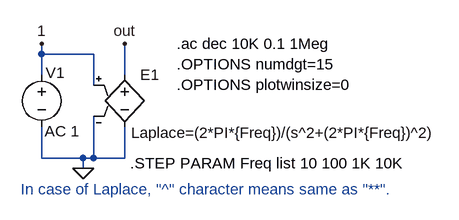
[diagram p0: schematic Fig_2-76-app_E-Laplace_Test_SIN.asc]
Fig_2-76-app_E-Laplace_Test_SIN.asc, the LTspice schematic file:
Version 4
SHEET 1 920 680
WIRE 32 112 32 96
WIRE 112 112 32 112
WIRE 32 144 32 112
WIRE 160 144 160 96
WIRE 112 160 112 112
WIRE 32 272 32 224
WIRE 96 272 32 272
WIRE 112 272 112 208
WIRE 112 272 96 272
WIRE 160 272 160 224
WIRE 160 272 112 272
WIRE 96 288 96 272
FLAG 96 288 0
FLAG 32 96 1
FLAG 160 96 out
SYMBOL e 160 128 R0
WINDOW 3 10 105 Left 2
SYMATTR Value Laplace=(2*PI*{Freq})/(s^2+(2*PI*{Freq})^2)
SYMATTR InstName E1
SYMBOL voltage 32 128 R0
WINDOW 123 5 103 Left 2
WINDOW 39 0 0 Left 2
WINDOW 0 6 13 Left 2
SYMATTR Value2 AC 1
SYMATTR InstName V1
SYMATTR Value ""
TEXT 240 96 Left 2 !.ac dec 10K 0.1 1Meg
TEXT 240 128 Left 2 !.OPTIONS numdgt=15\n.OPTIONS plotwinsize=0
TEXT 0 320 Left 2 ;In case of Laplace, "^" character means same as "**".
TEXT 168 280 Left 2 !.STEP PARAM Freq list 10 100 1K 10K

The netlist it stands for:
* Fig_2-76-app_E-Laplace_Test_SIN.asc
E1 out 0 1 0 Laplace=(2*PI*{Freq})/(s^2+(2*PI*{Freq})^2)
V1 1 0 AC 1
.ac dec 10K 0.1 1Meg
.OPTIONS numdgt=15
.OPTIONS plotwinsize=0
* In case of Laplace, "^" character means same as "**".
.STEP PARAM Freq list 10 100 1K 10K
.backanno
.end